# EAGLE design 4-20mA (EAGLE 6.5.0)
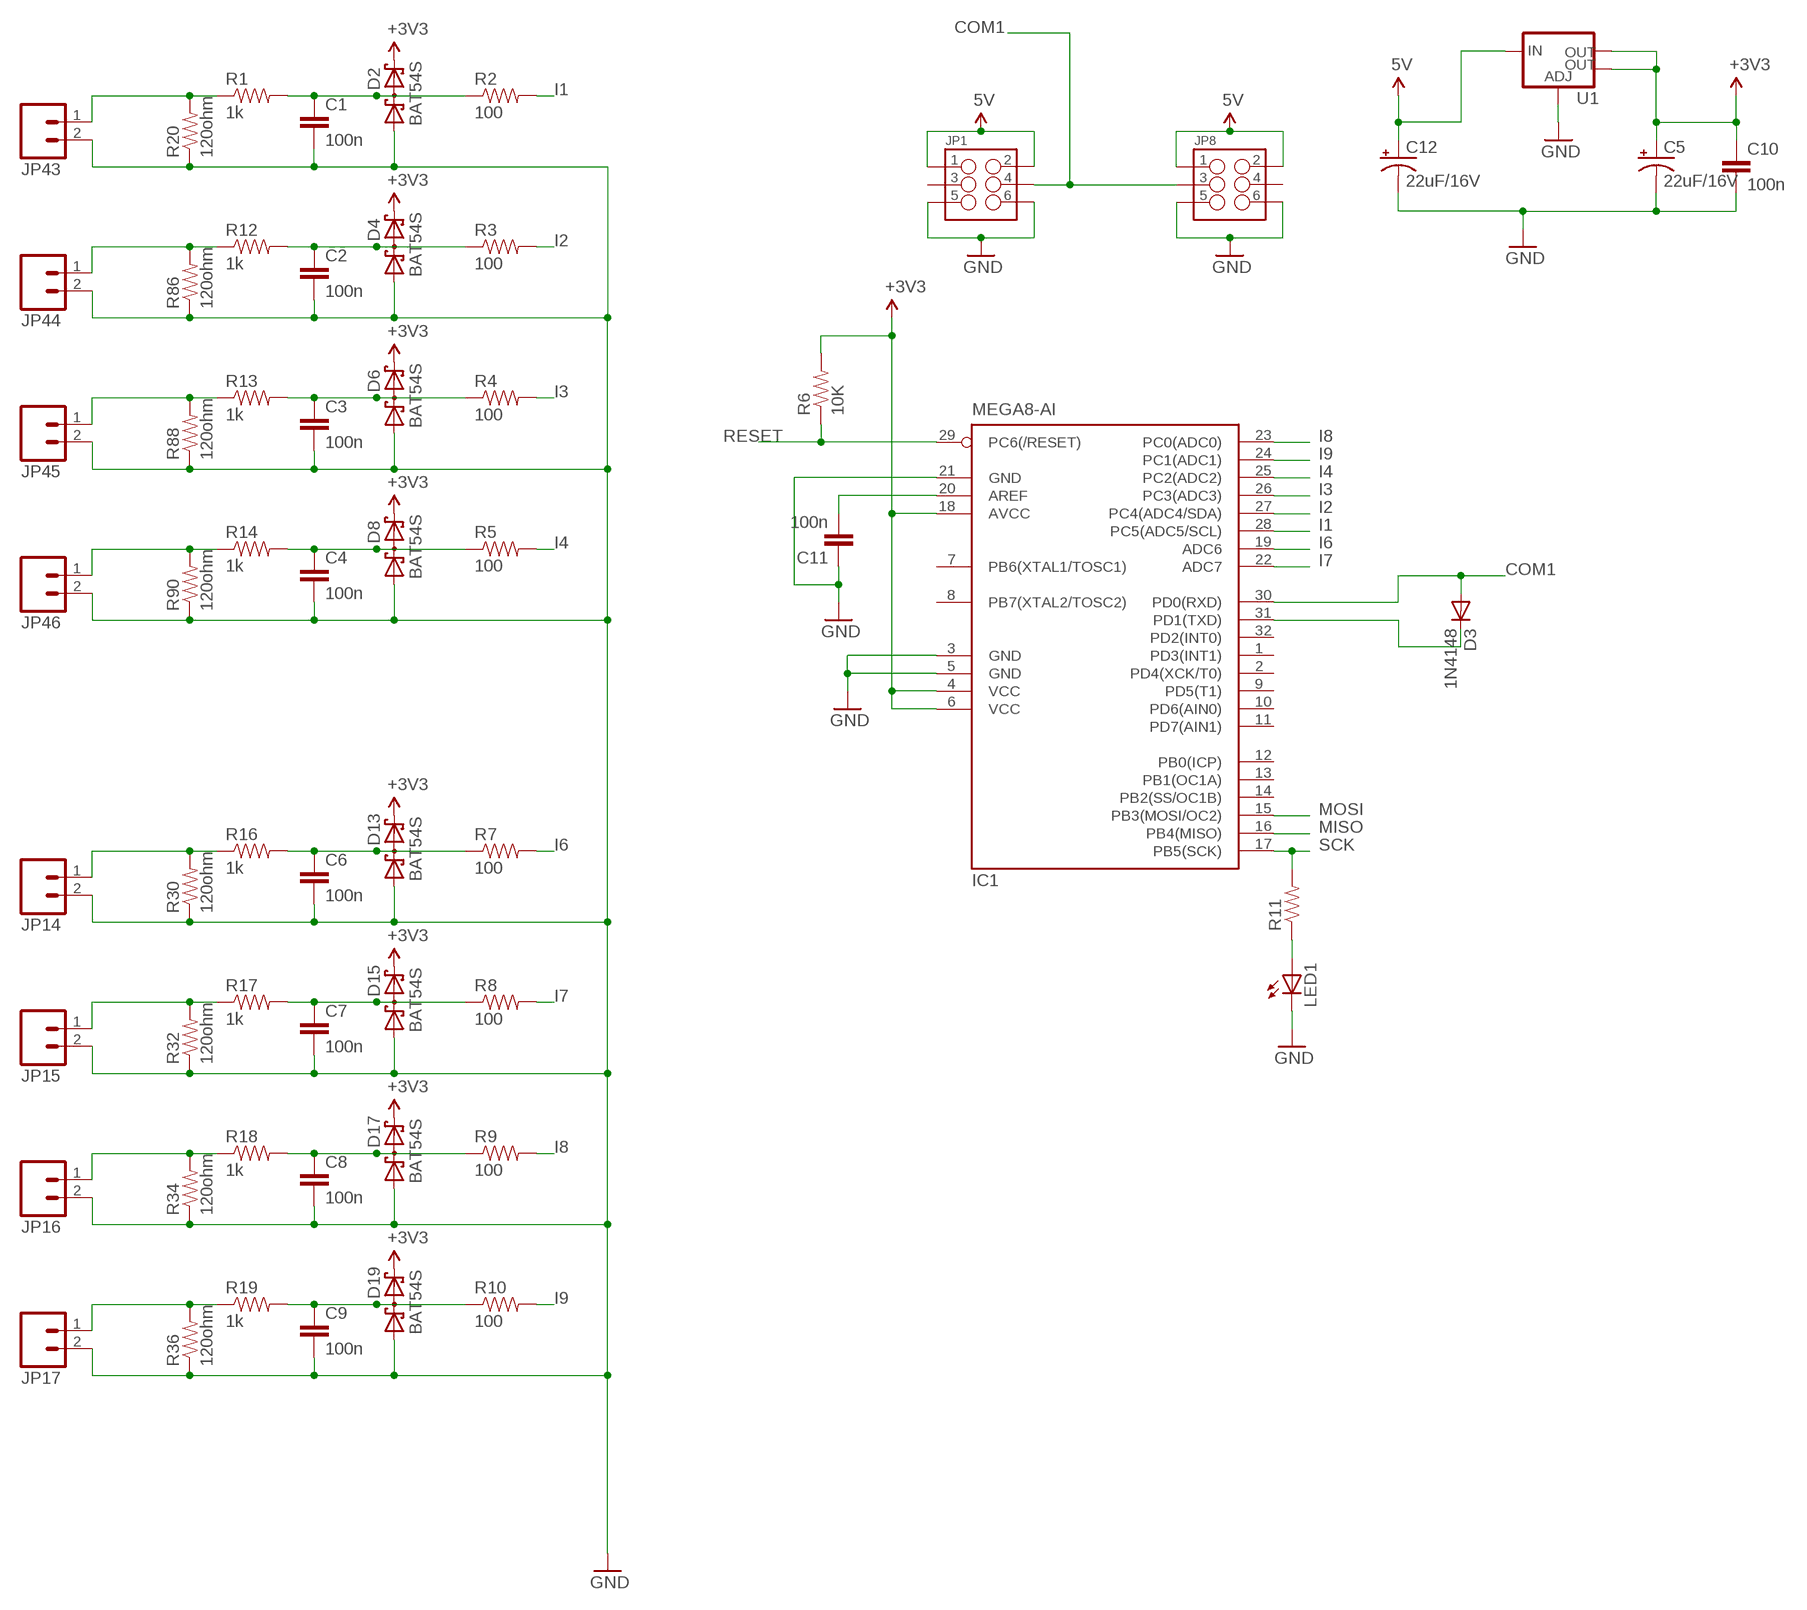
[diagram p0: schematic, sheet 1]

## Parts
C1  100n  CAP0805  [0805]
C2  100n  CAP0805  [0805]
C3  100n  CAP0805  [0805]
C4  100n  CAP0805  [0805]
C5  22uF/16V  CAP_POL1206  [EIA3216]
C6  100n  CAP0805  [0805]
C7  100n  CAP0805  [0805]
C8  100n  CAP0805  [0805]
C9  100n  CAP0805  [0805]
C10  100n  CAP0805  [0805]
C11  100n  CAP0805  [0805]
C12  22uF/16V  CAP_POL1206  [EIA3216]
D2  BAT54S  [SOT23]
D3  1N4148  DIODE-MINIMELF  [MINIMELF]
D4  BAT54S  [SOT23]
D6  BAT54S  [SOT23]
D8  BAT54S  [SOT23]
D13  BAT54S  [SOT23]
D15  BAT54S  [SOT23]
D17  BAT54S  [SOT23]
D19  BAT54S  [SOT23]
IC1  MEGA8-AI  [TQFP32-08]
JP1  M03X22X3_SILK_MALE_PTH  [2X3]
JP8  M03X22X3_SILK_MALE_PTH  [2X3]
JP14  M025MM  [SCREWTERMINAL-5MM-2]
JP15  M025MM  [SCREWTERMINAL-5MM-2]
JP16  M025MM  [SCREWTERMINAL-5MM-2]
JP17  M025MM  [SCREWTERMINAL-5MM-2]
JP43  M025MM  [SCREWTERMINAL-5MM-2]
JP44  M025MM  [SCREWTERMINAL-5MM-2]
JP45  M025MM  [SCREWTERMINAL-5MM-2]
JP46  M025MM  [SCREWTERMINAL-5MM-2]
LED1  LEDCHIP-LED0805  [CHIP-LED0805]
R1  1k  RESISTOR0805-RES  [0805]
R2  100  RESISTOR0805-RES  [0805]
R3  100  RESISTOR0805-RES  [0805]
R4  100  RESISTOR0805-RES  [0805]
R5  100  RESISTOR0805-RES  [0805]
R6  10K  RESISTOR0805-RES  [0805]
R7  100  RESISTOR0805-RES  [0805]
R8  100  RESISTOR0805-RES  [0805]
R9  100  RESISTOR0805-RES  [0805]
R10  100  RESISTOR0805-RES  [0805]
R11  RESISTOR0805-RES  [0805]
R12  1k  RESISTOR0805-RES  [0805]
R13  1k  RESISTOR0805-RES  [0805]
R14  1k  RESISTOR0805-RES  [0805]
R16  1k  RESISTOR0805-RES  [0805]
R17  1k  RESISTOR0805-RES  [0805]
R18  1k  RESISTOR0805-RES  [0805]
R19  1k  RESISTOR0805-RES  [0805]
R20  120ohm  RESISTOR2010  [R2010]
R30  120ohm  RESISTOR2010  [R2010]
R32  120ohm  RESISTOR2010  [R2010]
R34  120ohm  RESISTOR2010  [R2010]
R36  120ohm  RESISTOR2010  [R2010]
R86  120ohm  RESISTOR2010  [R2010]
R88  120ohm  RESISTOR2010  [R2010]
R90  120ohm  RESISTOR2010  [R2010]
U1  V_REG_LM1117SOT223  [SOT223]

## Nets
5V: C12.A(+) JP1.1 JP1.2 JP8.1 JP8.2 U1.3(IN)
COM1: D3.A IC1.30(PD0(RXD)) JP1.4 JP8.3
GND: C1.2 C2.2 C3.2 C4.2 C5.C(-) C6.2 C7.2 C8.2 C9.2 C10.2 C11.1 C12.C(-) D2.1(A1) D4.1(A1) D6.1(A1) D8.1(A1) D13.1(A1) D15.1(A1) D17.1(A1) D19.1(A1) IC1.3(GND) IC1.5(GND) IC1.21(GND) JP1.5 JP1.6 JP8.5 JP8.6 JP14.2 JP15.2 JP16.2 JP17.2 JP43.2 JP44.2 JP45.2 JP46.2 LED1.C R20.1 R30.1 R32.1 R34.1 R36.1 R86.1 R88.1 R90.1 U1.1(ADJ)
I1: IC1.28(PC5(ADC5/SCL)) R2.2
I2: IC1.27(PC4(ADC4/SDA)) R3.2
I3: IC1.26(PC3(ADC3)) R4.2
I4: IC1.25(PC2(ADC2)) R5.2
I6: IC1.19(ADC6) R7.2
I7: IC1.22(ADC7) R8.2
I8: IC1.23(PC0(ADC0)) R9.2
I9: IC1.24(PC1(ADC1)) R10.2
MISO: IC1.16(PB4(MISO))
MOSI: IC1.15(PB3(MOSI/OC2))
N$1: LED1.A R11.1
N$2: D3.C IC1.31(PD1(TXD))
N$5: C11.2 IC1.20(AREF)
N$13: C9.1 D19.3(C1A2) R10.1 R19.2
N$14: C8.1 D17.3(C1A2) R9.1 R18.2
N$15: C7.1 D15.3(C1A2) R8.1 R17.2
N$16: C6.1 D13.3(C1A2) R7.1 R16.2
N$18: C4.1 D8.3(C1A2) R5.1 R14.2
N$19: C3.1 D6.3(C1A2) R4.1 R13.2
N$20: C2.1 D4.3(C1A2) R3.1 R12.2
N$21: C1.1 D2.3(C1A2) R1.2 R2.1
N$38: JP43.1 R1.1 R20.2
N$99: JP14.1 R16.1 R30.2
N$104: JP44.1 R12.1 R86.2
N$105: JP45.1 R13.1 R88.2
N$106: JP46.1 R14.1 R90.2
N$107: JP15.1 R17.1 R32.2
N$108: JP16.1 R18.1 R34.2
N$109: JP17.1 R19.1 R36.2
RESET: IC1.29(PC6(/RESET)) R6.1
SCK: IC1.17(PB5(SCK)) R11.2
VCC: C5.A(+) C10.1 D2.2(C2) D4.2(C2) D6.2(C2) D8.2(C2) D13.2(C2) D15.2(C2) D17.2(C2) D19.2(C2) IC1.4(VCC) IC1.6(VCC) IC1.18(AVCC) R6.2 U1.2(OUT) U1.4(OUT) ; supply symbol labelled +3V3
Unconnected: IC1.1(PD3(INT1)) IC1.2(PD4(XCK/T0)) IC1.7(PB6(XTAL1/TOSC1)) IC1.8(PB7(XTAL2/TOSC2)) IC1.9(PD5(T1)) IC1.10(PD6(AIN0)) IC1.11(PD7(AIN1)) IC1.12(PB0(ICP)) IC1.13(PB1(OC1A)) IC1.14(PB2(SS/OC1B)) IC1.32(PD2(INT0)) JP1.3 JP8.4

## Library data of the parts
C1-C4 C6-C11 = SparkFun-Passives:CAP: Capacitor Standard 0603 ceramic capacitor, and 0.1" leaded capacitor.
C5 C12 = SparkFun-Passives:CAP_POL: Capacitor Polarized These are standard SMD and PTH capacitors. Normally 10uF, 47uF, and 100uF in electrolytic and tantalum varieties. Always verify the external diameter of the through hole cap, it varies with capacity, voltage, and manufacturer. The EIA devices should be standard.
D2 D4 D6 D8 D13 D15 D17 D19 = diode:BAT54S: Schottky Diodes Pin connection corrected 2011-05-04 Source: Fairchild .. BAT54.pdf
D3 = diode:DIODE-: DIODE
IC1 = atmel:MEGA8: MICROCONTROLLER 8 Kbytes FLASH, 1 kbytes SRAM, 512 bytes EEPROM, USART, 6-channel 10 bit ADC, 2-channel 8 bit ADC Pin compatible with Atmega48, ATMega88, ATMega168 Source: avr.lbr; MPN: ATMEGA8-16AU; OC_FARNELL: 9171371; OC_NEWARK: 73M8863
JP1 JP8 = SparkFun-Connectors:M03X2: 2x3 .1" header. Shrouded, with keying- CONN-10681 SMT- CONN-11415 Pogo pins- HW-11044; PROD_ID: CONN-09701
JP14-JP17 JP43-JP46 = SparkFun-Connectors:M02: Standard 2-pin 0.1" header. Use with - straight break away headers ( PRT-00116) - right angle break away headers (PRT-00553) - swiss pins (PRT-00743) - machine pins (PRT-00117) - female headers (PRT-00115) Molex polarized connector foot print use with: PRT-08233 with associated crimp pins and housings. 2.54_SCREWTERM for use with PRT-10571. 3.5mm Screw Terminal footprints for PRT-08084 5mm Screw Terminal footprints for use with PRT-08432; STOREFRONT_ID: PRT-08432
LED1 = led:LED: LED OSRAM: - CHIPLED LG R971, LG N971, LY N971, LG Q971, LY Q971, LO R971, LY R971 LH N974, LH R974 LS Q976, LO Q976, LY Q976 LO Q996 - Hyper CHIPLED LW Q18S LB Q993, LB Q99A, LB R99A - SideLED LS A670, LO A670, LY A670, LG A670, LP A670 LB A673, LV A673, LT A673, LW A673 LH A674 LY A675 LS A676, LA A676, LO A676, LY A676, LW A676 LS A679, LY A679, LG A679 - Hyper Micro SIDELED® LS Y876, LA Y876, LO Y876, LY Y876 LT Y87S - SmartLED LW L88C, LW L88S LB L89C, LB L89S, LG L890 LS L89K, LO L89K, LY L89K LS L896, LA L896, LO L896, LY L896 - TOPLED LS T670, LO T670, LY T670, LG T670, LP T670 LSG T670, LSP T670, LSY T670, LOP T670, LYG T670 LG T671, LOG T671, LSG T671 LB T673, LV T673, LT T673, LW T673 LH T674 LS T676, LA T676, LO T676, LY T676, LB T676, LH T676, LSB T676, LW T676 LB T67C, LV T67C, LT T67C, LS T67K, LO T67K, LY T67K, LW E67C LS E67B, LA E67B, LO E67B, LY E67B, LB E67C, LV E67C, LT E67C LW T67C LS T679, LY T679, LG T679 LS T770, LO T770, LY T770, LG T770, LP T770 LB T773, LV T773, LT T773, LW T773 LH T774 LS E675, LA E675, LY E675, LS T675 LS T776, LA T776, LO T776, LY T776, LB T776 LHGB T686 LT T68C, LB T68C - Hyper Mini TOPLED® LB M676 - Mini TOPLED Santana® LG M470 LS M47K, LO M47K, LY M47K Source: http://www.osram.convergy.de LUXEON: - LUMILED® LXK2-PW12-R00, LXK2-PW12-S00, LXK2-PW14-U00, LXK2-PW14-V00 LXK2-PM12-R00, LXK2-PM12-S00, LXK2-PM14-U00 LXK2-PE12-Q00, LXK2-PE12-R00, LXK2-PE12-S00, LXK2-PE14-T00, LXK2-PE14-U00 LXK2-PB12-K00, LXK2-PB12-L00, LXK2-PB12-M00, LXK2-PB14-N00, LXK2-PB14-P00, LXK2-PB14-Q00 LXK2-PR12-L00, LXK2-PR12-M00, LXK2-PR14-Q00, LXK2-PR14-R00 LXK2-PD12-Q00, LXK2-PD12-R00, LXK2-PD12-S00 LXK2-PH12-R00, LXK2-PH12-S00 LXK2-PL12-P00, LXK2-PL12-Q00, LXK2-PL12-R00 Source: www.luxeon.com KINGBRIGHT: KA-3528ASYC Source: www.kingbright.com
R1-R14 R16-R20 R30 R32 R34 R36 R86 R88 R90 = SparkFun-Passives:RESISTOR: Resistor Basic schematic elements and footprints for 0603, 1206, and PTH resistors.
U1 = SparkFun-PowerIC:V_REG_LM1117: Voltage Regulator LM1117 Standard adjustable voltage regulator but in SMD form. Spark Fun Electronics SKU : COM-00595; PROD_ID: VREG-08170

## Board
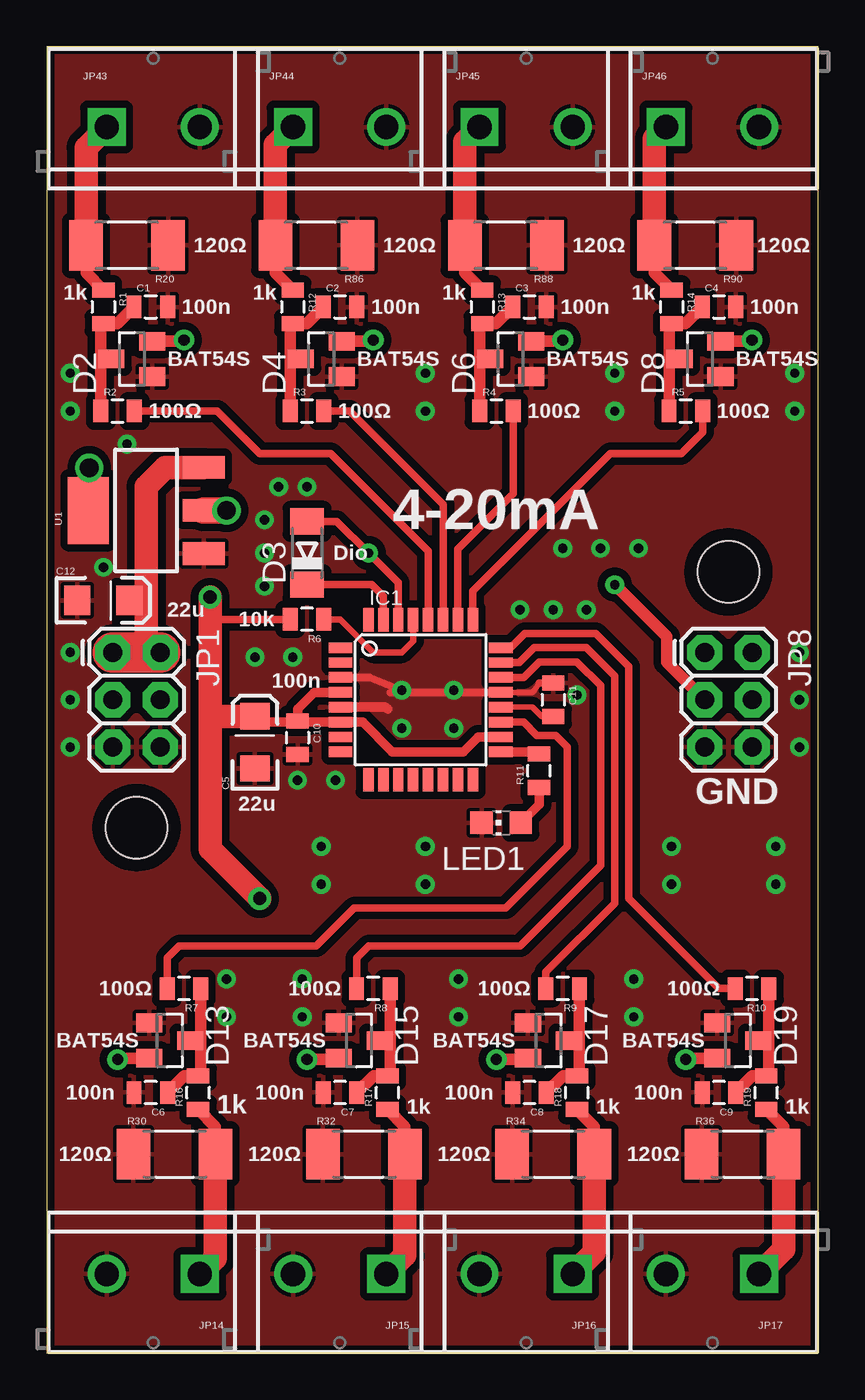
[diagram p1: board, top side]
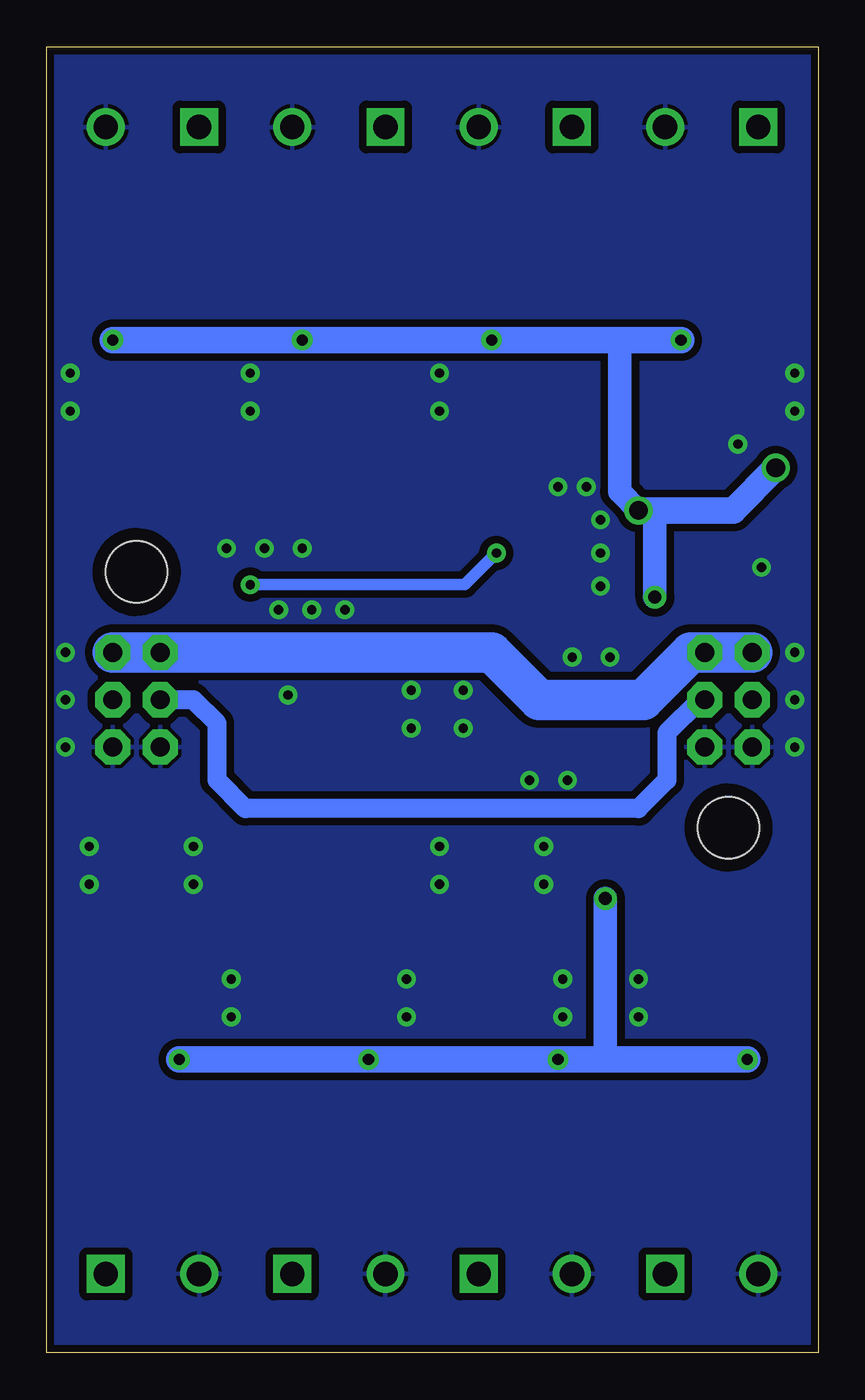
[diagram p2: board, bottom side, seen from below]

Size 41.4 x 70.1 mm. Coordinates in mm from the lower left corner, seen from the top.
Outline: 0,0 41.4,0 41.4,70.1 0,70.1 0,0
Copper layers (1*16): Top 0.035mm / dielectric 1.5mm / Bottom 0.035mm
Design rules "default *": minimum track width 8mil, minimum drill 0.4mm, track to track 8mil, track to pad 8mil, pad to pad 8mil, via to via 8mil, smd to smd 8mil, copper to edge 10mil, drill to drill 8mil, minimum pad ring 8mil, minimum via ring 10mil, stop-mask expansion 3mil, vias tented up to drill 0mil, thermal gap 8mil

### Footprints (pad centres in the part's own frame; a part is rotated, then mirrored left to right if it is on the bottom)
0805 = smd 0.8 x 1.2: 1 -0.9,0; 2 0.9,0
EIA3216 = smd 1.4 x 1.6: A 1.4,0; C -1.4,0
SOT23 = smd 1 x 1.4: 1 -0.95,-1.1; 2 0.95,-1.1; 3 0,1.1
MINIMELF = smd 1.4 x 1.8: A 1.7,0; C -1.7,0
TQFP32-08 = smd 1.27 x 0.559: 1 -4.293,2.8; 2 -4.293,2; 3 -4.293,1.2; 4 -4.293,0.4; 5 -4.293,-0.4; 6 -4.293,-1.2; 7 -4.293,-2; 8 -4.293,-2.8; 17 4.293,-2.8; 18 4.293,-2; 19 4.293,-1.2; 20 4.293,-0.4; 21 4.293,0.4; 22 4.293,1.2; 23 4.293,2; 24 4.293,2.8 | smd 0.559 x 1.27: 9 -2.8,-4.293; 10 -2,-4.293; 11 -1.2,-4.293; 12 -0.4,-4.293; 13 0.4,-4.293; 14 1.2,-4.293; 15 2,-4.293; 16 2.8,-4.293; 25 2.8,4.293; 26 2,4.293; 27 1.2,4.293; 28 0.4,4.293; 29 -0.4,4.293; 30 -1.2,4.293; 31 -2,4.293; 32 -2.8,4.293
2X3 = drill 1.016 pad 1.88 octagon: 1 0,0; 2 0,2.54; 3 2.54,0; 4 2.54,2.54; 5 5.08,0; 6 5.08,2.54
SCREWTERMINAL-5MM-2 = drill 1.3 pad 2.032 square: 1 0,0 | drill 1.3 pad 2.032: 2 5,0
CHIP-LED0805 = smd 1.2 x 1.2: A 0,-1.05; C 0,1.05
R2010 = smd 1.8 x 2.7: 1 -2.2,0; 2 2.2,0
STAND-OFF = hole 3.302: 0,0
SOT223 = smd 1.219 x 2.235: 1 -2.311,-3.099; 2 0,-3.099; 3 2.311,-3.099 | smd 3.6 x 2.2: 4 0,3.099

### Placement (x,y rotation side)
C1  5.59,56.13 0 top
C2  15.75,56.13 0 top
C3  25.91,56.13 0 top
C4  36.07,56.13 0 top
C5  11.18,32.77 90 top
C6  5.59,13.97 180 top
C7  15.75,13.97 180 top
C8  25.91,13.97 180 top
C9  36.07,13.97 180 top
C10  13.46,33.02 270 top
C11  27.18,35.05 270 top
C12  3.05,40.39 0 top
D2  4.57,53.34 90 top
D3  13.97,42.93 90 top
D4  14.73,53.34 90 top
D6  24.89,53.34 90 top
D8  35.05,53.34 90 top
D13  6.6,16.76 270 top
D15  16.76,16.76 270 top
D17  26.92,16.76 270 top
D19  37.08,16.76 270 top
IC1  20.07,35.05 0 top
JP1  3.56,37.59 270 top
JP8  35.31,37.59 270 top
JP14  8.22,4.24 180 top
JP15  18.22,4.24 180 top
JP16  28.22,4.24 180 top
JP17  38.22,4.24 180 top
JP43  3.22,65.79 0 top
JP44  13.22,65.79 0 top
JP45  23.22,65.79 0 top
JP46  33.22,65.79 0 top
LED1  24.38,28.45 90 top
R1  3.05,56.13 270 top
R2  3.81,50.55 0 top
R3  13.97,50.55 0 top
R4  24.13,50.55 0 top
R5  34.29,50.55 0 top
R6  13.97,39.37 180 top
R7  7.37,19.56 180 top
R8  17.53,19.56 180 top
R9  27.69,19.56 180 top
R10  37.85,19.56 180 top
R11  26.42,31.24 90 top
R12  13.21,56.13 270 top
R13  23.37,56.13 270 top
R14  33.53,56.13 270 top
R16  8.13,13.97 90 top
R17  18.29,13.97 90 top
R18  28.45,13.97 90 top
R19  38.61,13.97 90 top
R20  4.32,59.44 180 top
R30  6.86,10.67 0 top
R32  17.02,10.67 0 top
R34  27.18,10.67 0 top
R36  37.34,10.67 0 top
R86  14.48,59.44 180 top
R88  24.64,59.44 180 top
R90  34.8,59.44 180 top
STANDOFF2  STAND-OFF  [STAND-OFF]  36.58,41.91 180 top
STANDOFF3  STAND-OFF  [STAND-OFF]  4.83,28.19 180 top
U1  5.33,45.21 90 top

### Tracks (layer width: path | path; a pad name or v marks a point on that pad's centre or on a via)
5V
  Top 1.27: U1.3 6.38,47.52 5.33,46.48 5.33,40.39 | 5.33,40.39 5.33,37.59 4.57,37.59 | C12.A 5.33,40.39
  Top 2.184: JP1.1 4.57,37.59 JP1.2
  Bottom 2.184: JP1.1 JP1.2 6.86,37.59 9.4,35.05 14.99,35.05 17.53,37.59 JP8.1 JP8.2
COM1  (via drill 0.5)
  Top 0.406: IC1.30 18.87,41.33 v17.27,42.93 15.57,44.63 D3.A
  Top 0.61: JP8.3 33.27,37.08 33.27,38.43 v30.48,41.23
  Bottom 0.61: v30.48,41.23 18.97,41.23 v17.27,42.93
  Bottom 1.016: JP1.4 6.35,35.05 8.13,33.27 8.13,30.73 9.65,29.21 30.73,29.21 32.26,30.73 32.26,33.78 33.53,35.05 JP8.3
GND  (via drill 0.5)
  Top 0.305: 26.42,35.95 26.16,35.56 26.05,35.45 IC1.21
  Top 0.406: C11.1 26.42,35.95 | IC1.3 17.34,36.25 v19.05,35.56 18.43,35.45 IC1.21
  Top 0.508: IC1.5 18.18,34.65 18.29,34.54
  other vias: 21.84,35.56 15.49,30.73 3.05,42.16 4.32,48.77 1.27,50.55 19.05,33.53 21.84,33.53 11.18,37.34 13.21,37.34 20.32,52.58 20.32,50.55 30.48,50.55 30.48,52.58 40.13,52.58 40.13,50.55 1.27,52.58 13.97,46.48 11.68,41.15 25.4,39.88 27.18,39.88 28.96,39.88 14.73,25.15 14.73,27.18 20.32,25.15 20.32,27.18 13.72,18.03 13.72,20.07 22.1,20.07 22.1,18.03 9.65,20.07 9.65,18.03 31.5,20.07 31.5,18.03 13.46,30.73 28.45,35.31 33.53,27.18 33.53,25.15 39.12,27.18 39.12,25.15 1.27,37.59 1.27,35.05 1.27,32.51 40.39,37.59 40.39,35.05 40.39,32.51 12.45,46.48 11.68,42.93 27.69,43.18 29.72,43.18 31.75,43.18 11.68,44.7
  pour Bottom (isolate 0.406): 0,70.1 41.4,70.1 41.4,0 0,0
  pour Top (isolate 0.406): 0,70.1 41.4,70.1 41.4,0 0,0
I1
  Top 0.406: R2.2 9.14,50.55 11.43,48.26 15.24,48.26 20.47,43.03 IC1.28
I2
  Top 0.406: R3.2 16.26,50.55 21.27,45.54 IC1.27
I3
  Top 0.406: R4.2 25.03,46.11 22.07,43.15 IC1.26
I4
  Top 0.406: R5.2 35.19,49.41 34.04,48.26 30.23,48.26 22.86,40.89 IC1.25
I6
  Top 0.406: IC1.19 25.58,33.85 26.29,33.15 27.3,33.15 27.94,32.51 27.94,27.18 24.64,23.88 16.51,23.88 14.48,21.84 7.11,21.84 6.47,21.2 R7.2
I7
  Top 0.406: IC1.22 25.58,36.25 26.42,37.08 28.45,37.08 29.72,35.81 29.72,26.16 25.4,21.84 17.27,21.84 16.63,21.2 R8.2
I8
  Top 0.406: IC1.23 25.37,37.05 26.16,37.85 28.96,37.85 30.48,36.32 30.48,24.13 26.79,20.44 R9.2
I9
  Top 0.406: IC1.24 24.9,37.85 25.65,38.61 29.46,38.61 31.24,36.83 31.24,24.38 36.07,19.56 R10.2
N$1
  Top 0.508: R11.1 26.42,29.43 LED1.A
N$2
  Top 0.406: IC1.31 18.07,40.61 17.45,41.23 D3.C
N$5
  Top 0.305: IC1.20 26.05,34.65 26.55,34.15 C11.2
N$13
  Top 0.61: 38.75,16.76 38.75,14.87 R19.2 37.87,14.87 C9.1 | 38.75,16.76 R10.1 | D19.3 38.75,16.76
N$14
  Top 0.61: 28.59,16.76 28.59,14.87 R18.2 27.71,14.87 C8.1 | 28.59,16.76 R9.1 | D17.3 28.59,16.76
N$15
  Top 0.61: 18.43,16.76 18.43,14.87 R17.2 17.55,14.87 C7.1 | 18.43,16.76 R8.1 | D15.3 18.43,16.76
N$16
  Top 0.61: 8.27,16.76 8.27,14.87 R16.2 7.39,14.87 C6.1 | 8.27,16.76 R7.1 | D13.3 8.27,16.76
N$18
  Top 0.61: 33.39,53.34 33.39,55.23 R14.2 34.27,55.23 C4.1 | 33.39,53.34 R5.1 | D8.3 33.39,53.34
N$19
  Top 0.61: 23.23,53.34 23.23,55.23 R13.2 24.11,55.23 C3.1 | 23.23,53.34 R4.1 | D6.3 23.23,53.34
N$20
  Top 0.61: 13.07,53.34 13.07,55.23 R12.2 13.95,55.23 C2.1 | 13.07,53.34 R3.1 | D4.3 13.07,53.34
N$21
  Top 0.61: 2.91,53.34 2.91,55.23 R1.2 3.79,55.23 C1.1 | 2.91,53.34 R2.1 | D2.3 2.91,53.34
N$38
  Top 0.61: R1.1 2.12,57.96 R20.2
  Top 1.27: JP43.1 2.12,64.69 R20.2
N$99
  Top 0.61: R16.1 9.06,12.14 R30.2
  Top 1.27: 8.13,4.24 JP14.1 9.06,5.07 R30.2
N$104
  Top 0.61: R12.1 12.28,57.96 R86.2
  Top 1.27: 13.21,65.79 JP44.1 12.28,64.85 R86.2
N$105
  Top 0.61: R13.1 22.44,57.96 R88.2
  Top 1.27: 23.37,65.79 JP45.1 22.44,65.01 R88.2
N$106
  Top 0.61: R14.1 32.6,57.96 R90.2
  Top 1.27: 33.53,65.79 JP46.1 32.6,65.17 R90.2
N$107
  Top 0.61: R17.1 19.22,12.14 R32.2
  Top 1.27: JP15.1 19.22,5.23 R32.2
N$108
  Top 0.61: R18.1 29.38,12.14 R34.2
  Top 1.27: JP16.1 29.38,5.39 R34.2
N$109
  Top 0.61: R19.1 39.54,12.14 R36.2
  Top 1.27: JP17.1 39.54,5.55 R36.2
RESET
  Top 0.356: R6.1 15.75,39.37 17.53,37.59 19.05,37.59 19.67,38.21 IC1.29
SCK
  Top 0.508: IC1.17 26.31,32.25 R11.2
VCC  (via drill 0.6, 0.7, 1, 1 pad 1.02)
  Top 0.406: R6.2 8.77,39.37
  Top 0.508: IC1.18 23.15,33.05 22.35,32.26 18.54,32.26 16.95,33.85 IC1.6 13.46,33.85 | 13.46,33.85 C10.1 13.46,34.54 14.37,35.45 IC1.4 | 13.46,33.85 11.62,33.85 C5.A
  Top 0.61: D13.2 3.81,15.81 v3.81,15.75 | v34.29,15.75 34.29,15.81 D19.2 | D15.2 15.66,15.75 v13.97,15.75 | D17.2 25.82,15.75 v24.13,15.75 | D2.2 7.11,54.29 v7.37,54.36 | v37.85,54.36 37.85,54.29 D8.2 | D6.2 27.69,54.29 v27.69,54.36 | D4.2 17.27,54.29 v17.53,54.36
  Top 1.27: 8.77,34.04 8.77,27.05 v11.43,24.38 | 8.77,34.04 8.77,39.37 v8.77,40.56 | C5.A 8.9,34.17 8.77,34.04 | v2.29,47.5 2.29,45.21 U1.4
  Top 1.422: U1.2 v9.65,45.21
  Bottom 1.27: v11.43,24.38 11.43,15.75 | 10.67,54.36 10.67,46.23 v9.65,45.21 | v8.77,40.56 8.77,45.21 U1.2
  Bottom 1.422: v3.81,15.75 11.43,15.75 v13.97,15.75 v24.13,15.75 v34.29,15.75 | v7.37,54.36 10.67,54.36 v17.53,54.36 v27.69,54.36 v37.85,54.36 | v9.65,45.21 U1.2 4.57,45.21 v2.29,47.5

### Text on the board
tPlace: 120Ω | 120Ω | 120Ω | 120Ω | 1k | 1k | 1k | 1k | 100n | 100n | 100n | 100n | BAT54S | BAT54S | BAT54S | BAT54S | 100Ω | 100Ω | 100Ω | 100Ω | 4-20mA | Dio | 22u | 10k | 100n | 22u | GND | 100Ω | 100Ω | 100Ω | 100Ω | BAT54S | BAT54S | BAT54S | BAT54S | 100n | 100n | 100n | 100n | 1k | 1k | 1k | 1k | 120Ω | 120Ω | 120Ω | 120Ω